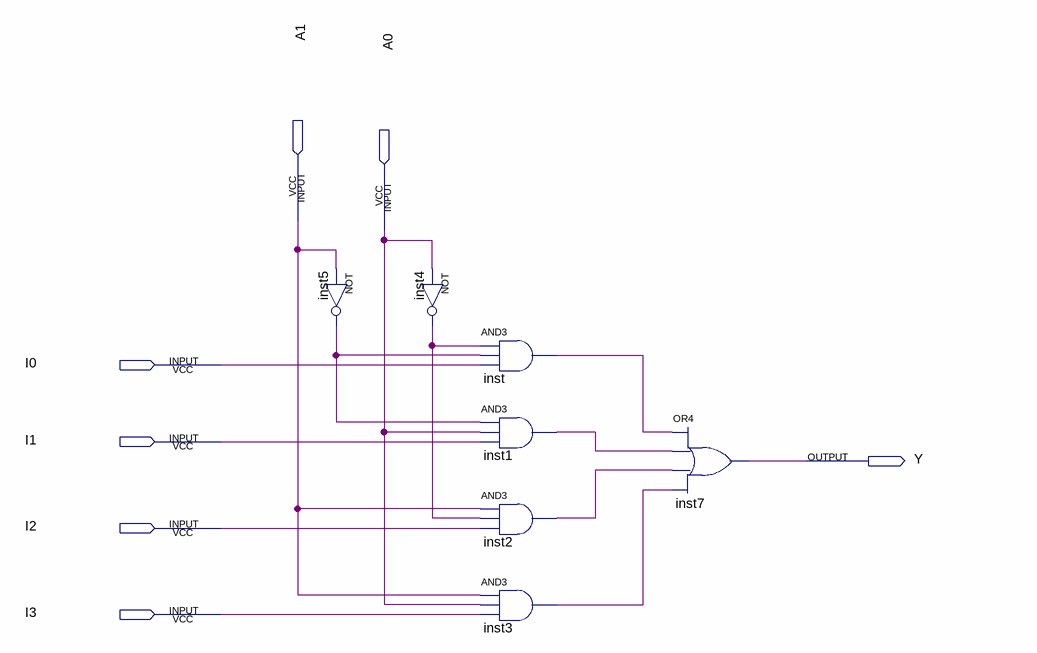
[diagram p0: schematic sheet]
// Quartus schematic MUX41.bdf as structural Verilog: 7 symbols, 7 pins
module MUX41 (
  input  A1,
  input  A0,
  input  I0,
  input  I1,
  input  I2,
  input  I3,
  output Y
);

  wire inst1_out, inst2_out, inst3_out, inst4_out, inst5_out, inst_out;

  not inst5 (inst5_out, A1);
  not inst4 (inst4_out, A0);
  and inst (inst_out, inst4_out, inst5_out, I0);
  and inst1 (inst1_out, inst5_out, A0, I1);
  and inst2 (inst2_out, A1, inst4_out, I2);
  and inst3 (inst3_out, A1, A0, I3);
  or inst7 (Y, inst_out, inst1_out, inst2_out, inst3_out);
endmodule
